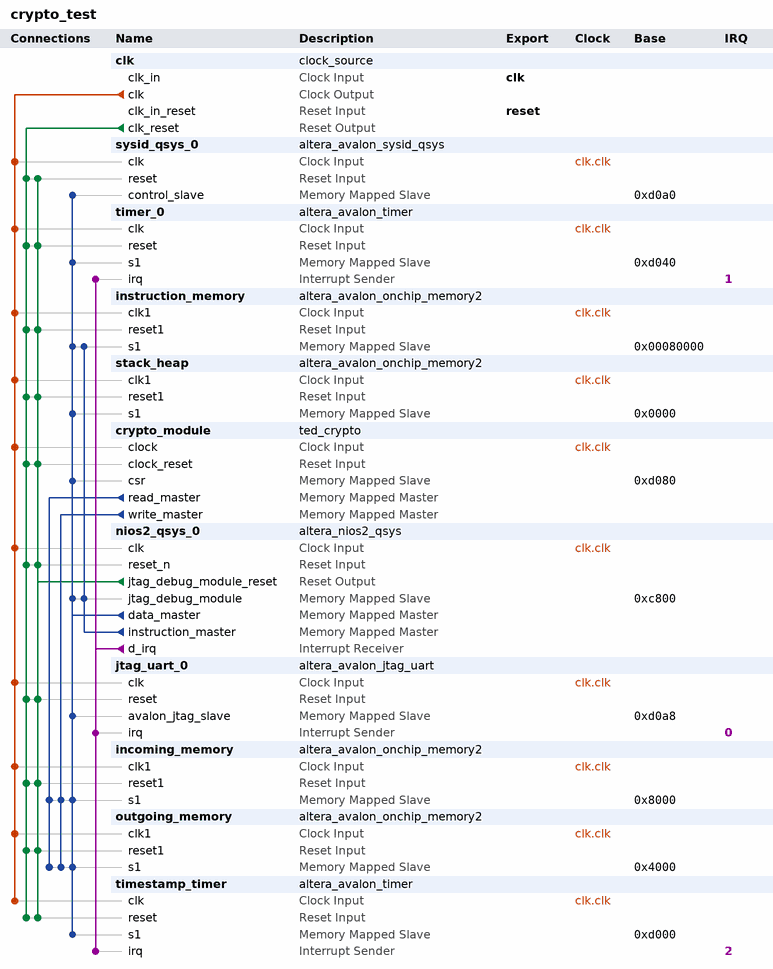
[diagram p0: system contents]
# Platform Designer (Qsys) system crypto_test, Cyclone IV E EP4CE115F29C7
# Parameters at their usual value, and those the tool derives, are not listed.
package require -exact qsys 14.1
create_system crypto_test
set_project_property DEVICE_FAMILY {Cyclone IV E}
set_project_property DEVICE EP4CE115F29C7

add_instance clk clock_source 14.1
set_instance_parameter_value clk clockFrequency 50000000

add_instance sysid_qsys_0 altera_avalon_sysid_qsys 14.1
set_instance_parameter_value sysid_qsys_0 id 305419896

add_instance timer_0 altera_avalon_timer 14.1
set_instance_parameter_value timer_0 counterSize 64
set_instance_parameter_value timer_0 period 1
set_instance_parameter_value timer_0 periodUnits MSEC

add_instance instruction_memory altera_avalon_onchip_memory2 14.1
set_instance_parameter_value instruction_memory dataWidth 32
set_instance_parameter_value instruction_memory dualPort false
set_instance_parameter_value instruction_memory initMemContent true
set_instance_parameter_value instruction_memory initializationFileName onchip_mem.hex
set_instance_parameter_value instruction_memory memorySize 200000

add_instance stack_heap altera_avalon_onchip_memory2 14.1
set_instance_parameter_value stack_heap dataWidth 32
set_instance_parameter_value stack_heap dualPort false
set_instance_parameter_value stack_heap initMemContent true
set_instance_parameter_value stack_heap initializationFileName onchip_mem.hex
set_instance_parameter_value stack_heap memorySize 16384

add_instance crypto_module ted_crypto 2.0

add_instance nios2_qsys_0 altera_nios2_qsys 14.1
set_instance_parameter_value nios2_qsys_0 breakSlave nios2_qsys_0.jtag_debug_module
set_instance_parameter_value nios2_qsys_0 exceptionSlave instruction_memory.s1
set_instance_parameter_value nios2_qsys_0 icache_size 4096
set_instance_parameter_value nios2_qsys_0 impl Tiny
set_instance_parameter_value nios2_qsys_0 mmu_TLBMissExcSlave None
set_instance_parameter_value nios2_qsys_0 resetSlave instruction_memory.s1
set_instance_parameter_value nios2_qsys_0 resetrequest_enabled true

add_instance jtag_uart_0 altera_avalon_jtag_uart 14.1
set_instance_parameter_value jtag_uart_0 simInteractiveOptions NO_INTERACTIVE_WINDOWS

add_instance incoming_memory altera_avalon_onchip_memory2 14.1
set_instance_parameter_value incoming_memory dataWidth 32
set_instance_parameter_value incoming_memory dualPort false
set_instance_parameter_value incoming_memory initMemContent true
set_instance_parameter_value incoming_memory initializationFileName onchip_mem.hex
set_instance_parameter_value incoming_memory memorySize 16384

add_instance outgoing_memory altera_avalon_onchip_memory2 14.1
set_instance_parameter_value outgoing_memory dataWidth 32
set_instance_parameter_value outgoing_memory dualPort false
set_instance_parameter_value outgoing_memory initMemContent true
set_instance_parameter_value outgoing_memory initializationFileName onchip_mem.hex
set_instance_parameter_value outgoing_memory memorySize 16356

add_instance timestamp_timer altera_avalon_timer 14.1
set_instance_parameter_value timestamp_timer counterSize 64
set_instance_parameter_value timestamp_timer period 1
set_instance_parameter_value timestamp_timer periodUnits USEC

# connections
add_connection clk.clk crypto_module.clock clock
add_connection clk.clk incoming_memory.clk1 clock
add_connection clk.clk instruction_memory.clk1 clock
add_connection clk.clk jtag_uart_0.clk clock
add_connection clk.clk nios2_qsys_0.clk clock
add_connection clk.clk outgoing_memory.clk1 clock
add_connection clk.clk stack_heap.clk1 clock
add_connection clk.clk sysid_qsys_0.clk clock
add_connection clk.clk timer_0.clk clock
add_connection clk.clk timestamp_timer.clk clock
add_connection clk.clk_reset crypto_module.clock_reset reset
add_connection clk.clk_reset incoming_memory.reset1 reset
add_connection clk.clk_reset instruction_memory.reset1 reset
add_connection clk.clk_reset jtag_uart_0.reset reset
add_connection clk.clk_reset nios2_qsys_0.reset_n reset
add_connection clk.clk_reset outgoing_memory.reset1 reset
add_connection clk.clk_reset stack_heap.reset1 reset
add_connection clk.clk_reset sysid_qsys_0.reset reset
add_connection clk.clk_reset timer_0.reset reset
add_connection clk.clk_reset timestamp_timer.reset reset
add_connection nios2_qsys_0.jtag_debug_module_reset crypto_module.clock_reset reset
add_connection nios2_qsys_0.jtag_debug_module_reset incoming_memory.reset1 reset
add_connection nios2_qsys_0.jtag_debug_module_reset instruction_memory.reset1 reset
add_connection nios2_qsys_0.jtag_debug_module_reset jtag_uart_0.reset reset
add_connection nios2_qsys_0.jtag_debug_module_reset nios2_qsys_0.reset_n reset
add_connection nios2_qsys_0.jtag_debug_module_reset outgoing_memory.reset1 reset
add_connection nios2_qsys_0.jtag_debug_module_reset stack_heap.reset1 reset
add_connection nios2_qsys_0.jtag_debug_module_reset sysid_qsys_0.reset reset
add_connection nios2_qsys_0.jtag_debug_module_reset timer_0.reset reset
add_connection nios2_qsys_0.jtag_debug_module_reset timestamp_timer.reset reset
add_connection crypto_module.read_master incoming_memory.s1 avalon
set_connection_parameter_value crypto_module.read_master/incoming_memory.s1 arbitrationPriority 50
set_connection_parameter_value crypto_module.read_master/incoming_memory.s1 baseAddress 0x8000
add_connection crypto_module.read_master outgoing_memory.s1 avalon
set_connection_parameter_value crypto_module.read_master/outgoing_memory.s1 arbitrationPriority 50
set_connection_parameter_value crypto_module.read_master/outgoing_memory.s1 baseAddress 0x4000
add_connection crypto_module.write_master incoming_memory.s1 avalon
set_connection_parameter_value crypto_module.write_master/incoming_memory.s1 arbitrationPriority 60
set_connection_parameter_value crypto_module.write_master/incoming_memory.s1 baseAddress 0x8000
add_connection crypto_module.write_master outgoing_memory.s1 avalon
set_connection_parameter_value crypto_module.write_master/outgoing_memory.s1 arbitrationPriority 60
set_connection_parameter_value crypto_module.write_master/outgoing_memory.s1 baseAddress 0x4000
add_connection nios2_qsys_0.data_master crypto_module.csr avalon
set_connection_parameter_value nios2_qsys_0.data_master/crypto_module.csr baseAddress 0xd080
add_connection nios2_qsys_0.data_master incoming_memory.s1 avalon
set_connection_parameter_value nios2_qsys_0.data_master/incoming_memory.s1 baseAddress 0x8000
add_connection nios2_qsys_0.data_master instruction_memory.s1 avalon
set_connection_parameter_value nios2_qsys_0.data_master/instruction_memory.s1 baseAddress 0x00080000
add_connection nios2_qsys_0.data_master jtag_uart_0.avalon_jtag_slave avalon
set_connection_parameter_value nios2_qsys_0.data_master/jtag_uart_0.avalon_jtag_slave baseAddress 0xd0a8
add_connection nios2_qsys_0.data_master nios2_qsys_0.jtag_debug_module avalon
set_connection_parameter_value nios2_qsys_0.data_master/nios2_qsys_0.jtag_debug_module baseAddress 0xc800
add_connection nios2_qsys_0.data_master outgoing_memory.s1 avalon
set_connection_parameter_value nios2_qsys_0.data_master/outgoing_memory.s1 baseAddress 0x4000
add_connection nios2_qsys_0.data_master stack_heap.s1 avalon
set_connection_parameter_value nios2_qsys_0.data_master/stack_heap.s1 baseAddress 0x0000
add_connection nios2_qsys_0.data_master sysid_qsys_0.control_slave avalon
set_connection_parameter_value nios2_qsys_0.data_master/sysid_qsys_0.control_slave baseAddress 0xd0a0
add_connection nios2_qsys_0.data_master timer_0.s1 avalon
set_connection_parameter_value nios2_qsys_0.data_master/timer_0.s1 baseAddress 0xd040
add_connection nios2_qsys_0.data_master timestamp_timer.s1 avalon
set_connection_parameter_value nios2_qsys_0.data_master/timestamp_timer.s1 baseAddress 0xd000
add_connection nios2_qsys_0.instruction_master instruction_memory.s1 avalon
set_connection_parameter_value nios2_qsys_0.instruction_master/instruction_memory.s1 baseAddress 0x00080000
add_connection nios2_qsys_0.instruction_master nios2_qsys_0.jtag_debug_module avalon
set_connection_parameter_value nios2_qsys_0.instruction_master/nios2_qsys_0.jtag_debug_module baseAddress 0xc800
add_connection nios2_qsys_0.d_irq jtag_uart_0.irq interrupt
set_connection_parameter_value nios2_qsys_0.d_irq/jtag_uart_0.irq irqNumber 0
add_connection nios2_qsys_0.d_irq timer_0.irq interrupt
set_connection_parameter_value nios2_qsys_0.d_irq/timer_0.irq irqNumber 1
add_connection nios2_qsys_0.d_irq timestamp_timer.irq interrupt
set_connection_parameter_value nios2_qsys_0.d_irq/timestamp_timer.irq irqNumber 2

# exported interfaces
add_interface clk clock sink
set_interface_property clk EXPORT_OF clk.clk_in
add_interface reset reset sink
set_interface_property reset EXPORT_OF clk.clk_in_reset

set_interconnect_requirement {$system} qsys_mm.clockCrossingAdapter HANDSHAKE
set_interconnect_requirement {$system} qsys_mm.insertDefaultSlave FALSE
set_interconnect_requirement {$system} qsys_mm.maxAdditionalLatency 1

save_system crypto_test.qsys
